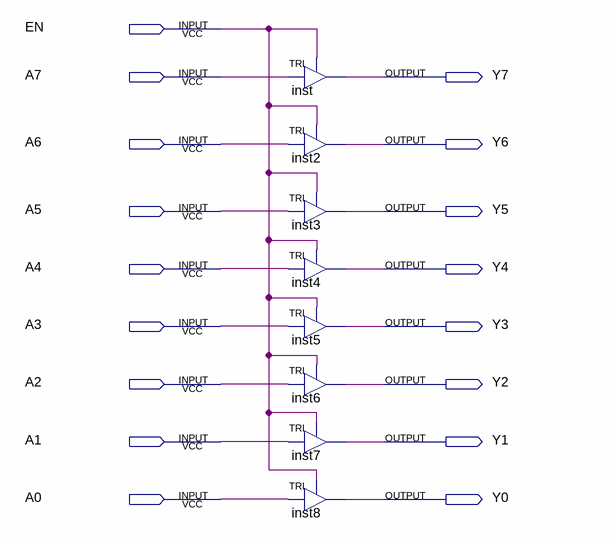
[diagram p0: schematic sheet]
// Quartus schematic tri-door.bdf as structural Verilog: 8 symbols, 17 pins
module \tri-door  (
  input  EN,
  input  A7,
  input  A6,
  input  A5,
  input  A4,
  input  A3,
  input  A2,
  input  A1,
  input  A0,
  output Y7,
  output Y6,
  output Y5,
  output Y4,
  output Y3,
  output Y2,
  output Y1,
  output Y0
);

  TRI inst (.IN(A7), .OE(EN), .OUT(Y7));
  TRI inst2 (.IN(A6), .OE(EN), .OUT(Y6));
  TRI inst3 (.IN(A5), .OE(EN), .OUT(Y5));
  TRI inst4 (.IN(A4), .OE(EN), .OUT(Y4));
  TRI inst5 (.IN(A3), .OE(EN), .OUT(Y3));
  TRI inst6 (.IN(A2), .OE(EN), .OUT(Y2));
  TRI inst7 (.IN(A1), .OE(EN), .OUT(Y1));
  TRI inst8 (.IN(A0), .OE(EN), .OUT(Y0));
endmodule
